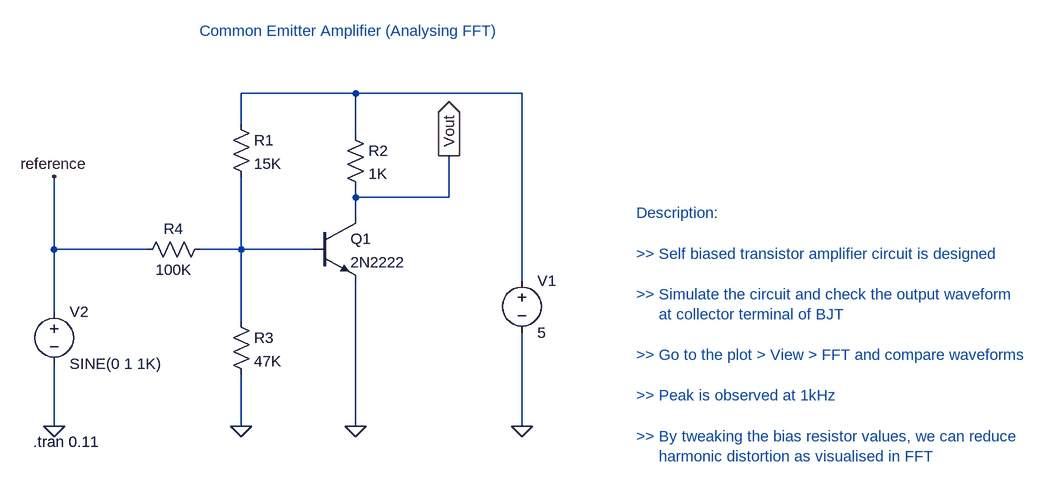
[diagram p0: schematic 10. CE Amplifier FFT.asc]
10. CE Amplifier FFT.asc, the LTspice schematic file:
Version 4
SHEET 1 1512 680
WIRE 176 -144 0 -144
WIRE 432 -144 176 -144
WIRE 0 -96 0 -144
WIRE 176 -80 176 -144
WIRE 176 16 176 0
WIRE 320 16 320 -48
WIRE 320 16 176 16
WIRE 176 48 176 16
WIRE -288 96 -288 -16
WIRE -144 96 -288 96
WIRE 0 96 0 -16
WIRE 0 96 -64 96
WIRE 112 96 0 96
WIRE 432 144 432 -144
WIRE -288 192 -288 96
WIRE 0 208 0 96
WIRE -288 368 -288 272
WIRE 0 368 0 288
WIRE 176 368 176 144
WIRE 432 368 432 224
FLAG 176 368 0
FLAG 0 368 0
FLAG -288 368 0
FLAG 432 368 0
FLAG -288 -16 reference
FLAG 320 -48 Vout
IOPIN 320 -48 Out
SYMBOL npn 112 48 R0
SYMATTR InstName Q1
SYMATTR Value 2N2222
SYMBOL voltage 432 128 R0
WINDOW 123 0 0 Left 0
WINDOW 39 0 0 Left 0
SYMATTR InstName V1
SYMATTR Value 5
SYMBOL voltage -288 176 R0
WINDOW 123 0 0 Left 0
WINDOW 39 0 0 Left 0
SYMATTR InstName V2
SYMATTR Value SINE(0 1 1K)
SYMBOL res -16 -112 R0
SYMATTR InstName R1
SYMATTR Value 15K
SYMBOL res 160 -96 R0
SYMATTR InstName R2
SYMATTR Value 1K
SYMBOL res -16 192 R0
SYMATTR InstName R3
SYMATTR Value 47K
SYMBOL res -48 80 R90
WINDOW 0 0 56 VBottom 2
WINDOW 3 32 56 VTop 2
SYMATTR InstName R4
SYMATTR Value 100K
TEXT -320 392 Left 2 !.tran 0.11
TEXT -64 -240 Left 2 ;Common Emitter Amplifier (Analysing FFT)
TEXT 608 40 Left 2 ;Description:\n \n>> Self biased transistor amplifier circuit is designed \n \n>> Simulate the circuit and check the output waveform\n     at collector terminal of BJT\n \n>> Go to the plot > View > FFT and compare waveforms\n \n>> Peak is observed at 1kHz \n \n>> By tweaking the bias resistor values, we can reduce \n     harmonic distortion as visualised in FFT

The netlist it stands for:
* 10. CE Amplifier FFT.asc
Q1 Vout N002 0 0 2N2222
V1 N001 0 5
V2 reference 0 SINE(0 1 1K)
R1 N001 N002 15K
R2 N001 Vout 1K
R3 N002 0 47K
R4 N002 reference 100K
.model NPN NPN
.model PNP PNP
.lib standard.bjt
.tran 0.11
* Common Emitter Amplifier (Analysing FFT)
* Description:
* >> Self biased transistor amplifier circuit is designed
* >> Simulate the circuit and check the output waveform
*      at collector terminal of BJT
* >> Go to the plot > View > FFT and compare waveforms
* >> Peak is observed at 1kHz
* >> By tweaking the bias resistor values, we can reduce
*      harmonic distortion as visualised in FFT
.backanno
.end